# EAGLE design PA (EAGLE 6.5.0)
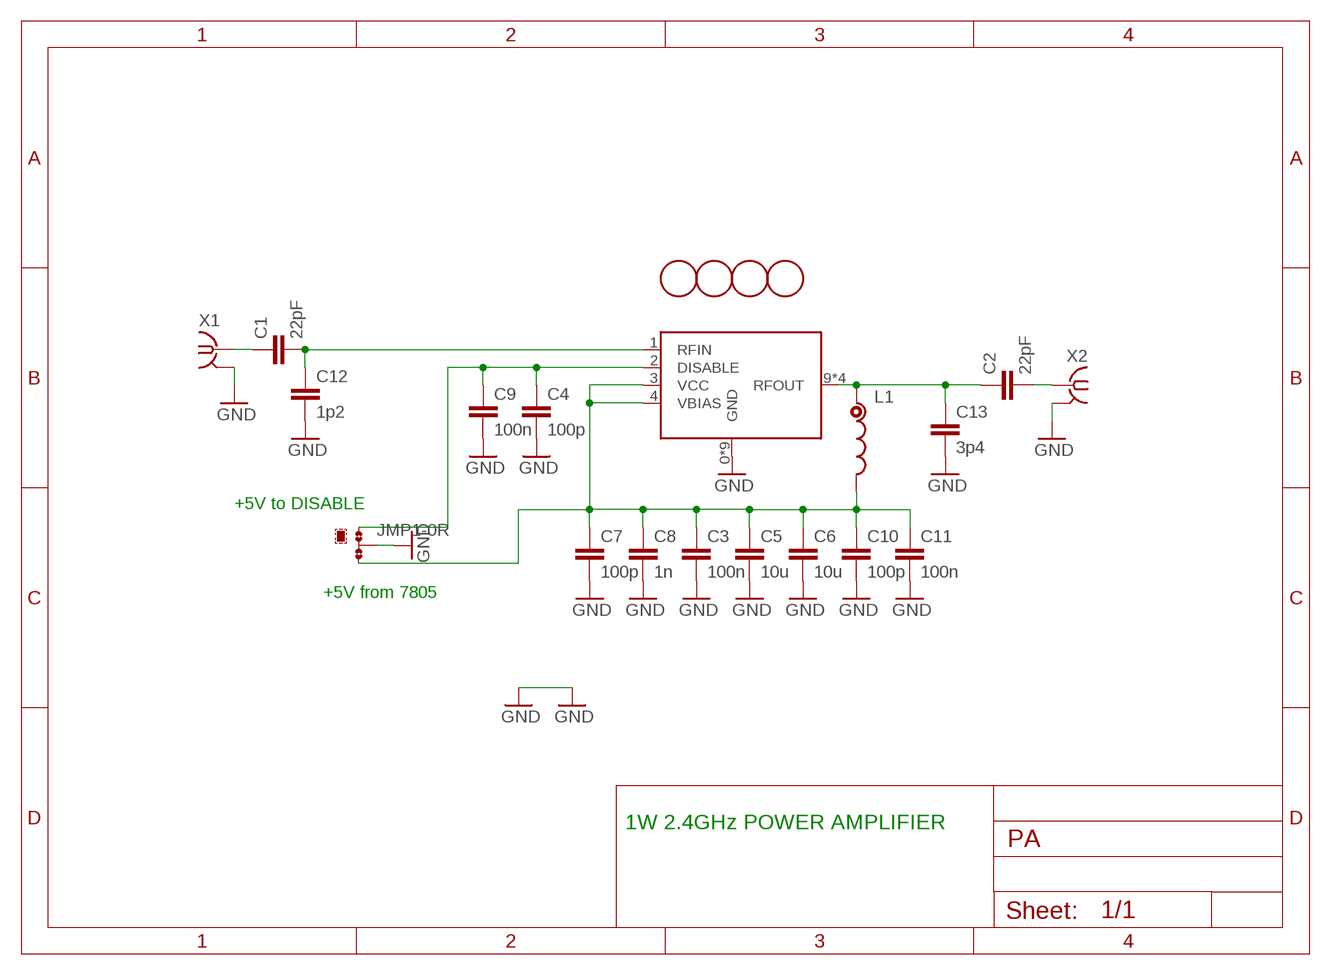
[diagram p0: schematic, sheet 1]

## Parts
C1  22pF  C-EUC0603  [C0603]
C2  22pF  C-EUC0603  [C0603]
C3  100n  C-EUC0603  [C0603]
C4  100p  C-EUC0603  [C0603]
C5  10u  C-EUC1210  [C1210]
C6  10u  C-EUC1210  [C1210]
C7  100p  C-EUC0603  [C0603]
C8  1n  C-EUC0603  [C0603]
C9  100n  C-EUC0603  [C0603]
C10  100p  C-EUC0603  [C0603]
C11  100n  C-EUC0603  [C0603]
C12  1p2  C-EUC0603  [C0603]
C13  3p4  C-EUC0603  [C0603]
JMP1  0R-JUMPB  [B0R-JMP]
L1  INDUCTOR0603  [0603]
U$1  ADL5606  [LFCSP-16-4X4]
U$2  FIDUCIAL  [FIDUCIAL_1MM]
U$3  FIDUCIAL  [FIDUCIAL_1MM]
U$4  FIDUCIAL  [FIDUCIAL_1MM]
U$5  FIDUCIAL  [FIDUCIAL_1MM]
X1  SMA-142-0711-821/826  [J502-ND-142-0711-821/826]
X2  SMA-142-0711-821/826  [J502-ND-142-0711-821/826]

## Nets
GND: C3.2 C4.2 C5.2 C6.2 C7.2 C8.2 C9.2 C10.2 C11.2 C12.2 C13.2 JMP1.2 U$1.0(GND) U$1.5(GND) U$1.6(GND) U$1.7(GND) U$1.8(GND) U$1.13(GND) U$1.14(GND) U$1.15(GND) U$1.16(GND) X1.G@1 X1.G@2 X1.G@3 X1.G@4 X2.G@1 X2.G@2 X2.G@3 X2.G@4
N$1: C1.1 X1.1
N$2: C2.1 C13.1 L1.1 U$1.9(RFOUT) U$1.10(RFOUT) U$1.11(RFOUT) U$1.12(RFOUT)
N$3: C4.1 C9.1 JMP1.1 U$1.2(DISABLE)
N$4: C3.1 C5.1 C6.1 C7.1 C8.1 C10.1 C11.1 JMP1.3 L1.2 U$1.3(VCC) U$1.4(VBIAS)
N$5: C2.2 X2.1
N$6: C1.2 C12.1 U$1.1(RFIN)

## Notes on the sheet
- +5V to DISABLE
- +5V from 7805
- 1W 2.4GHz POWER AMPLIFIER

## Library data of the parts
C1-C13 = rcl:C-EU: CAPACITOR, European symbol
JMP1 = jump-0r-smd:0R-JUMP: SMD 0R 0805 Jumper
L1 = aditya_main:INDUCTOR: Inductors Basic Inductor/Choke - 0603 and 1206. Footprints are not proven and vary greatly between part numbers.
U$1 = untitled:ADL5606
U$2-U$5 = tracker (2):FIDUCIAL: For use by pick and place machines to calibrate the vision/machine, 1mm By microbuilder.eu
X1 X2 = con-coax:SMA-: SMA 50 Ohm End Launch Jack Receptacle - Round Contact Johnson Components Source: www.johnsoncomponents.com .. J502-ND.pdf; MF: JOHNSON COMPONENTS; MPN: 142-0711-821; OC_FARNELL: 1019328; OC_NEWARK: 16F3627

## Board
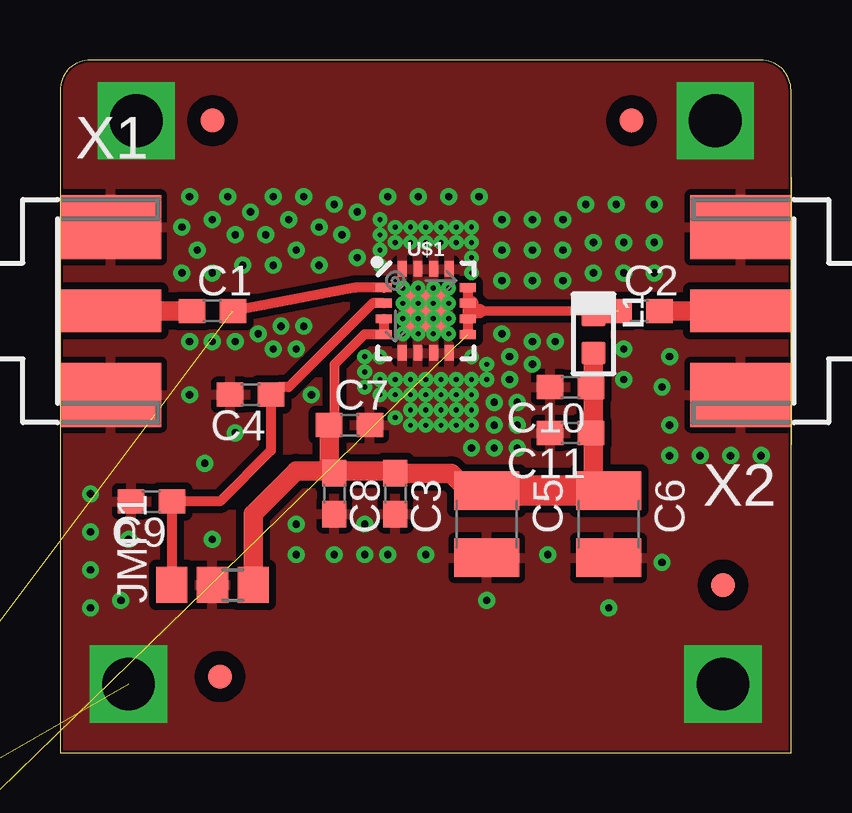
[diagram p1: board, top side]
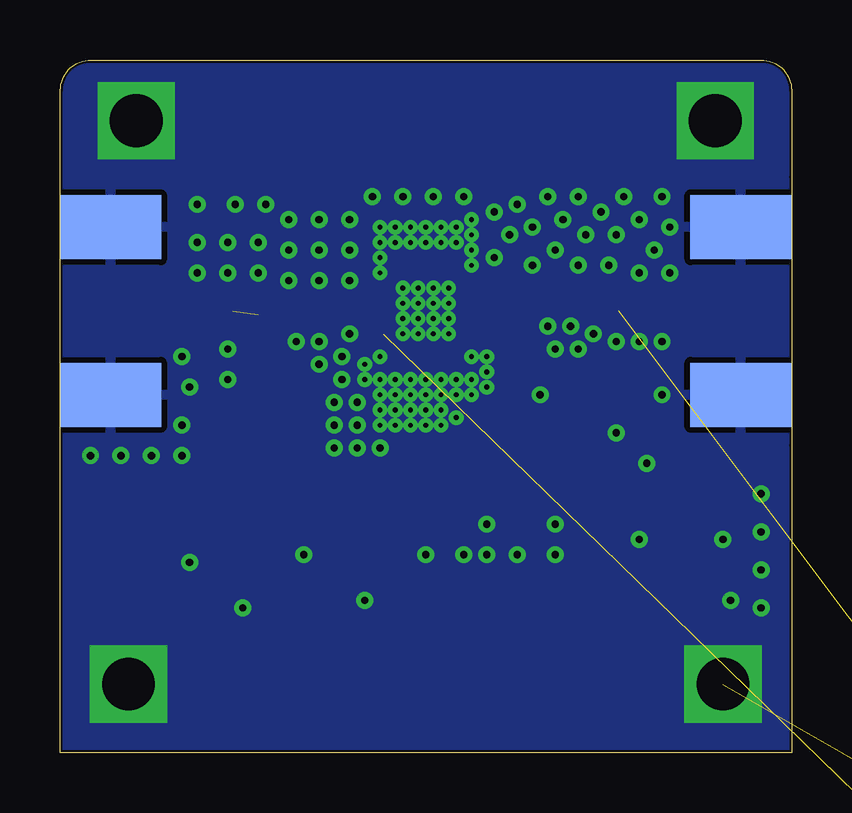
[diagram p2: board, bottom side, seen from below]

Size 30.48 x 28.88 mm. Coordinates in mm from the lower left corner, seen from the top.
Outline: 0,0 30.46,0 30.46,27.61 arc90 29.19,28.88 1.27,28.88 arc90 0,27.61 0,0
Copper layers (1*16): Top 0.035mm / dielectric 1.5mm / Bottom 0.035mm
Design rules "default *": minimum track width 10mil, minimum drill 24mil, track to track 0.3mm, track to pad 0.3mm, pad to pad 0.3mm, via to via 0.3mm, smd to smd 1mil, copper to edge 4mil, drill to drill 8mil, minimum pad ring 10mil, minimum via ring 8mil, stop-mask expansion 10mil, vias tented up to drill 12mil, thermal gap 10mil

### Footprints (pad centres in the part's own frame; a part is rotated, then mirrored left to right if it is on the bottom)
C0603 = smd 1.1 x 1: 1 -0.85,0; 2 0.85,0
C1210 = smd 1.6 x 2.7: 1 -1.4,0; 2 1.4,0
B0R-JMP = smd 1.5 x 1.3: 1 0,1.7; 2 0,0; 3 0,-1.7
0603 = smd 0.95 x 1: 1 -0.8,0; 2 0.8,0
LFCSP-16-4X4 = smd 1.75 x 1.75: 0 0,0 | smd 0.65 x 0.37: 1 -1.75,0.975; 2 -1.75,0.325; 3 -1.75,-0.325; 4 -1.75,-0.975; 9 1.75,-0.975; 10 1.75,-0.325; 11 1.75,0.325; 12 1.75,0.975 | smd 0.37 x 0.65: 5 -0.975,-1.75; 6 -0.325,-1.75; 7 0.325,-1.75; 8 0.975,-1.75; 13 0.975,1.75; 14 0.325,1.75; 15 -0.325,1.75; 16 -0.975,1.75
FIDUCIAL_1MM = smd 1 x 1: 1 0,0
J502-ND-142-0711-821/826 = smd 4.191 x 1.778: 1 2.115,0 | smd 4.191 x 2.667: G@1 2.115,3.495; G@2 2.115,-3.495 | smd 4.191 x 2.667 bottom: G@3 2.115,3.495; G@4 2.115,-3.495

### Placement (x,y rotation side)
C1  6.35,18.41 0 top
C2  24.13,18.41 0 top
C3  13.97,10.79 270 top
C4  7.94,14.92 180 top
C5  17.78,9.53 270 top
C6  22.86,9.53 270 top
C7  12.06,13.65 0 top
C8  11.43,10.79 270 top
C9  3.81,10.48 180 top
C10  21.27,15.24 180 top
C11  21.27,13.34 180 top
C12  -7.94,-2.86 0 top  (outside the outline)
C13  -7.94,-7.62 0 top  (outside the outline)
JMP1  6.35,6.99 90 top
L1  22.23,17.46 270 top
U$1  15.24,18.41 0 top
U$2  23.81,26.35 0 top
U$3  6.67,3.17 0 top
U$4  27.62,6.99 0 top
U$5  6.35,26.35 0 top
X1  0,18.41 0 top
X2  30.48,18.41 180 top

### Tracks (layer width: path | path; a pad name or v marks a point on that pad's centre or on a via)
GND  (via drill 0.2 pad 0.41, 0.3, 2.2)  (2 unrouted)
  other vias: 3.17,26.35 27.3,26.35 22.86,6.03 27.62,2.86 2.86,2.86 5.4,14.92 13.97,21.27 14.29,19.37 14.92,19.37 15.56,19.37 16.19,19.37 16.19,18.73 16.19,18.1 16.19,17.46 15.56,17.46 15.56,18.1 15.56,18.73 14.29,18.73 14.92,18.73 14.29,18.1 14.29,17.46 14.92,17.46 14.92,18.1 13.34,20.32 13.34,20.95 14.61,21.27 15.24,21.27 15.88,21.27 16.51,21.27 16.51,21.91 15.88,21.91 15.24,21.91 14.61,21.91 13.97,21.91 13.34,21.59 17.78,16.19 13.34,16.51 17.14,16.51 17.14,15.56 16.51,15.56 15.88,15.56 15.24,15.56 14.61,15.56 13.97,15.56 13.34,15.56 14.61,14.92 14.61,14.29 15.88,14.92 16.51,14.92 17.14,14.92 17.14,14.29 16.51,14.29 15.88,14.29 17.14,21.27 17.14,21.91 17.14,20.64 17.14,20 15.24,14.92 15.24,14.29 14.61,13.65 15.24,13.65 15.88,13.65 16.51,13.65 17.14,13.65 12.7,15.88 12.7,16.51 13.34,22.23 8.89,16.83 9.21,17.78 10.16,17.78 12.38,20.64 10.79,20.32 8.89,20.32 5.08,20 6.35,20 7.62,20.32 5.4,17.14 6.35,17.14 7.3,17.14 8.26,17.46 9.84,16.83 10.48,14.92 12.7,15.24 13.97,14.92 13.34,14.92 13.97,13.97 17.78,15.56 1.27,10.79 1.27,9.21 1.27,7.62 1.27,6.03 2.54,6.35 17.78,6.35 20.32,8.26 15.24,8.26 25.08,7.94 13.65,8.26 12.7,9.53 12.7,8.26 11.43,8.26 9.84,9.53 6.35,8.89 25.08,15.24 9.84,20.95 5.71,20.95 11.75,21.59 12.38,22.54 10.79,21.91 8.57,21.59 7.3,21.59 5.08,21.91 6.35,22.23 5.4,23.18 7.94,22.54 9.53,22.23 6.99,23.18 8.89,23.18 10.16,23.18 11.43,22.86 13.65,23.18 14.92,23.18 16.19,23.18 17.46,23.18 18.41,22.23 18.41,20.95 18.41,19.68 19.68,19.68 19.68,20.95 19.68,22.23 20.95,22.23 20.95,20.95 20.95,19.68 22.23,20 23.5,20 24.77,20 22.23,21.27 23.5,21.27 24.77,21.27 24.77,22.86 23.18,22.86 21.91,22.86 18.41,17.46 18.1,13.65 20.64,17.14 19.68,17.14 23.5,16.83 23.5,15.56 19.05,14.61 19.68,16.19 18.1,14.61 18.73,15.56 18.73,16.51 25.4,16.51 25.4,13.65 25.4,12.38 26.67,12.38 27.94,12.38 29.21,12.38 19.05,13.65 19.05,12.7 18.1,12.7 17.14,12.7 6.03,12.06 7.3,13.34 2.86,8.89 9.84,8.26
  pour Top: 0,29.53 31.75,29.53 31.75,0 0,0
  pour Bottom: -1.27,29.84 31.75,29.84 31.75,0 -1.27,0
N$1
  Top 0.813: C1.1 X1.1
N$2  (2 unrouted)
  Top 0.406: U$1.12 U$1.11 | U$1.9 U$1.10 U$1.11 | U$1.11 17.14,18.74 17.14,18.73 | 17.14,18.74 17.14,18.41 | 17.46,18.41 23.27,18.42 C2.1
  Top 0.61: U$1.11 17.14,18.74 | 17.14,18.41 17.46,18.41
N$3
  Top 0.406: U$1.2 13.03,18.74 9.53,15.24 9.11,15.24 C4.1 8.79,12.6 6.67,10.48 C9.1 JMP1.1
N$4
  Top 0.406: U$1.3 U$1.4 12.68,17.44 11.43,16.19 11.43,13.87 C7.1 | 22.23,15.34 C10.1 | C11.1 22.23,13.34
  Top 0.813: JMP1.3 8.05,9.96 9.84,11.75 11.43,11.75 | 11.43,11.75 13.87,11.75 C3.1 16.3,11.64 17.14,10.79 17.65,10.79 C5.1 | C7.1 11.21,11.86 C8.1 11.43,11.75 | 22.23,10.93 22.23,13.34 22.23,15.34 L1.2
  Top 1.27: C6.1 22.23,10.93 C5.1
N$5
  Top 0.813: C2.2 X2.1
N$6  (1 unrouted)
  Top 0.406: U$1.1 12.3,19.39 C1.2

### Text on the board
tStop: POWER AMP | LA3PNA 2019